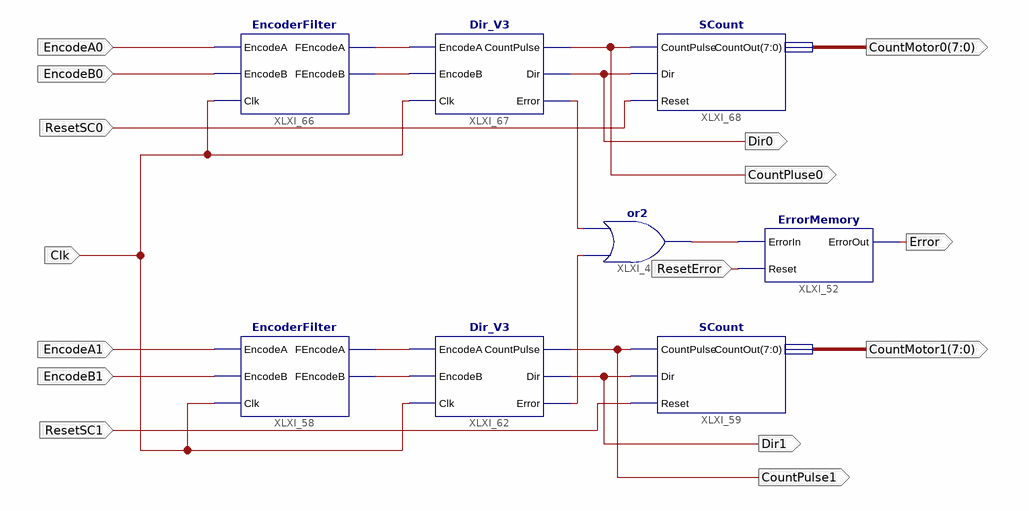
[diagram p0: schematic sheet 1]
// Xilinx ISE schematic Encoders.sch (spartan3e) as structural Verilog: 8 symbols, 15 ports
module Encoders (
  input  Clk,
  input  ResetSC1,
  input  EncodeB1,
  input  EncodeA1,
  input  EncodeA0,
  input  EncodeB0,
  input  ResetSC0,
  input  ResetError,
  output CountPulse1,
  output Dir1,
  output [7:0] CountMotor1,
  output [7:0] CountMotor0,
  output Dir0,
  output CountPluse0,
  output Error
);

  wire XLXN_326, XLXN_351, XLXN_352, XLXN_362, XLXN_372, XLXN_373, XLXN_376;

  SCount XLXI_59 (.CountPulse(CountPulse1), .Dir(Dir1), .Reset(ResetSC1), .CountOut(CountMotor1));
  Dir_V3 XLXI_62 (
    .EncodeA(XLXN_351), .EncodeB(XLXN_352), .Clk(Clk), .CountPulse(CountPulse1), .Dir(Dir1), .Error(XLXN_362));
  EncoderFilter XLXI_58 (.EncodeA(EncodeA1), .EncodeB(EncodeB1), .FEncodeA(XLXN_351), .FEncodeB(XLXN_352), .Clk(Clk));
  EncoderFilter XLXI_66 (.EncodeA(EncodeA0), .EncodeB(EncodeB0), .FEncodeA(XLXN_372), .FEncodeB(XLXN_373), .Clk(Clk));
  Dir_V3 XLXI_67 (
    .EncodeA(XLXN_372), .EncodeB(XLXN_373), .Clk(Clk), .CountPulse(CountPluse0), .Dir(Dir0), .Error(XLXN_376));
  SCount XLXI_68 (.CountPulse(CountPluse0), .Dir(Dir0), .Reset(ResetSC0), .CountOut(CountMotor0));
  or XLXI_45 (XLXN_326, XLXN_362, XLXN_376);
  ErrorMemory XLXI_52 (.ErrorIn(XLXN_326), .Reset(ResetError), .ErrorOut(Error));
endmodule
